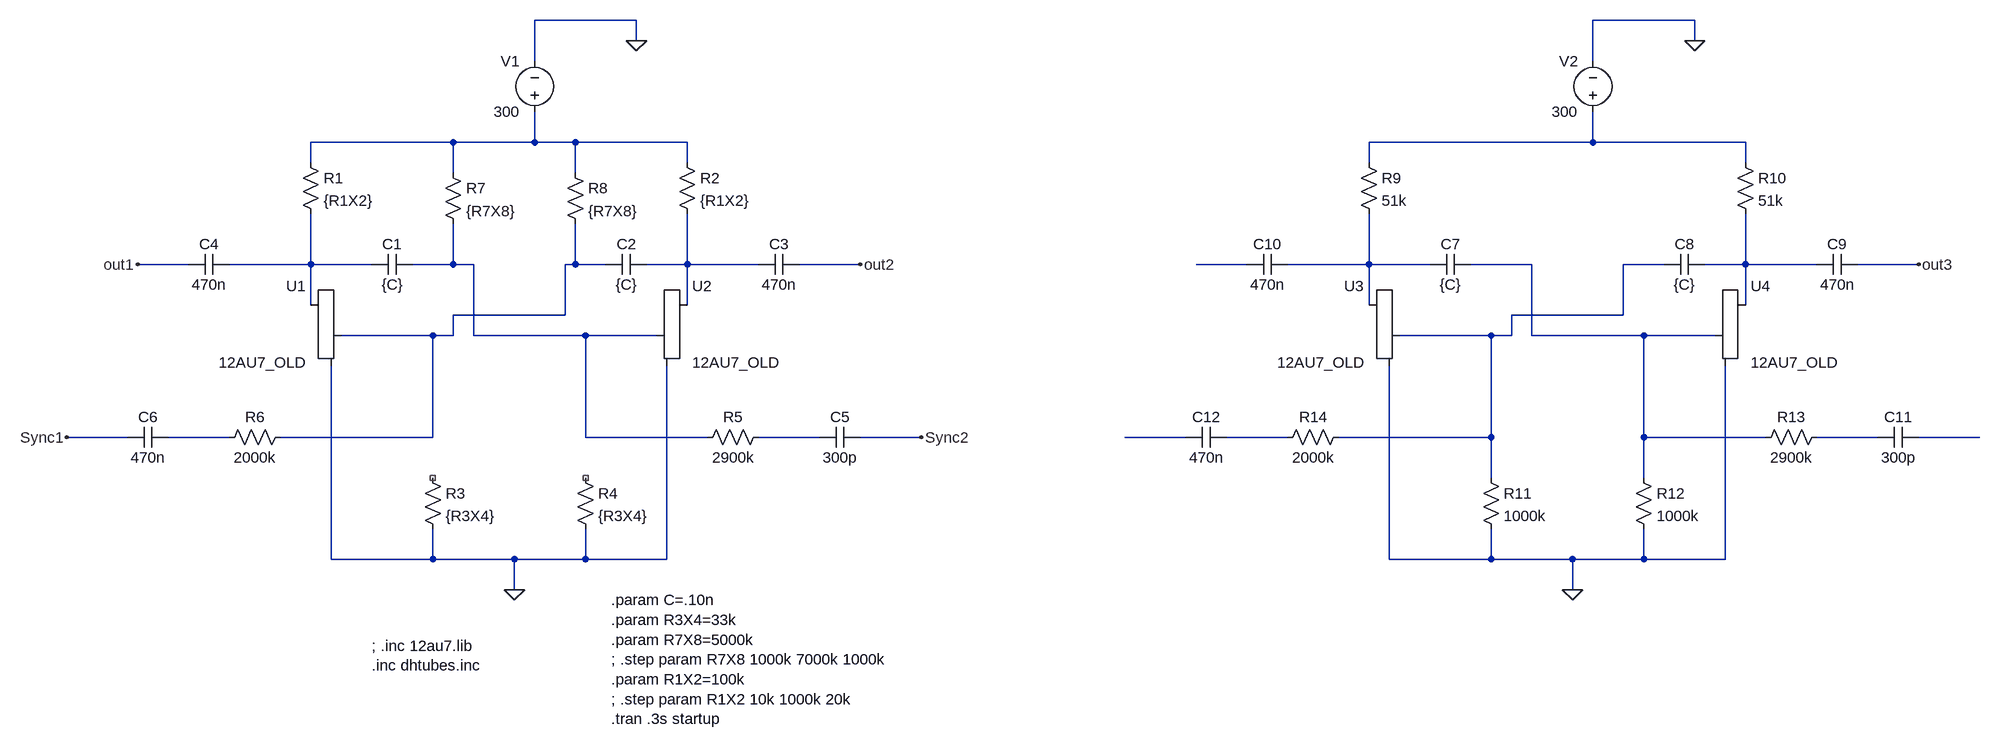
[diagram p0: schematic Multivibrator2.asc]
Multivibrator2.asc, the LTspice schematic file:
Version 4
SHEET 1 2860 824
WIRE 656 -272 496 -272
WIRE 2320 -272 2160 -272
WIRE 656 -240 656 -272
WIRE 2320 -240 2320 -272
WIRE 496 -208 496 -272
WIRE 2160 -208 2160 -272
WIRE 368 -80 144 -80
WIRE 496 -80 496 -128
WIRE 496 -80 368 -80
WIRE 560 -80 496 -80
WIRE 736 -80 560 -80
WIRE 2160 -80 2160 -128
WIRE 2160 -80 1808 -80
WIRE 2400 -80 2160 -80
WIRE 144 -48 144 -80
WIRE 736 -48 736 -80
WIRE 1808 -48 1808 -80
WIRE 2400 -48 2400 -80
WIRE 368 -32 368 -80
WIRE 560 -32 560 -80
WIRE -48 112 -128 112
WIRE 144 112 144 32
WIRE 144 112 16 112
WIRE 240 112 144 112
WIRE 368 112 368 48
WIRE 368 112 304 112
WIRE 400 112 368 112
WIRE 560 112 560 48
WIRE 560 112 544 112
WIRE 608 112 560 112
WIRE 736 112 736 32
WIRE 736 112 672 112
WIRE 848 112 736 112
WIRE 1008 112 912 112
WIRE 1616 112 1536 112
WIRE 1808 112 1808 32
WIRE 1808 112 1680 112
WIRE 1904 112 1808 112
WIRE 2064 112 1968 112
WIRE 2272 112 2208 112
WIRE 2400 112 2400 32
WIRE 2400 112 2336 112
WIRE 2512 112 2400 112
WIRE 2672 112 2576 112
WIRE 144 176 144 112
WIRE 736 176 736 112
WIRE 1808 176 1808 112
WIRE 2400 176 2400 112
WIRE 544 192 544 112
WIRE 544 192 368 192
WIRE 2208 192 2208 112
WIRE 2208 192 2032 192
WIRE 336 224 192 224
WIRE 368 224 368 192
WIRE 368 224 336 224
WIRE 400 224 400 112
WIRE 576 224 400 224
WIRE 688 224 576 224
WIRE 2000 224 1856 224
WIRE 2032 224 2032 192
WIRE 2032 224 2000 224
WIRE 2064 224 2064 112
WIRE 2240 224 2064 224
WIRE 2352 224 2240 224
WIRE -144 384 -240 384
WIRE 16 384 -80 384
WIRE 336 384 336 224
WIRE 336 384 96 384
WIRE 576 384 576 224
WIRE 768 384 576 384
WIRE 944 384 848 384
WIRE 1104 384 1008 384
WIRE 1520 384 1424 384
WIRE 1680 384 1584 384
WIRE 2000 384 2000 224
WIRE 2000 384 1760 384
WIRE 2240 384 2240 224
WIRE 2432 384 2240 384
WIRE 2608 384 2512 384
WIRE 2768 384 2672 384
WIRE 2000 448 2000 384
WIRE 2240 448 2240 384
WIRE 176 576 176 272
WIRE 336 576 336 528
WIRE 336 576 176 576
WIRE 464 576 336 576
WIRE 576 576 576 528
WIRE 576 576 464 576
WIRE 704 576 704 272
WIRE 704 576 576 576
WIRE 1840 576 1840 272
WIRE 2000 576 2000 528
WIRE 2000 576 1840 576
WIRE 2128 576 2000 576
WIRE 2240 576 2240 528
WIRE 2240 576 2128 576
WIRE 2368 576 2368 272
WIRE 2368 576 2240 576
WIRE 464 624 464 576
WIRE 2128 624 2128 576
FLAG 464 624 0
FLAG 656 -240 0
FLAG -128 112 out1
FLAG 1008 112 out2
FLAG 1104 384 Sync2
FLAG -240 384 Sync1
FLAG 2128 624 0
FLAG 2320 -240 0
FLAG 2672 112 out3
SYMBOL voltage 496 -112 R180
WINDOW 0 24 96 Left 2
WINDOW 3 24 16 Left 2
WINDOW 123 0 0 Left 0
WINDOW 39 0 0 Left 0
SYMATTR InstName V1
SYMATTR Value 300
SYMBOL Misc\\triode 144 224 M0
SYMATTR InstName U1
SYMATTR SpiceModel 12AU7_OLD
SYMATTR Value 12AU7_OLD
SYMBOL Misc\\triode 736 224 R0
SYMATTR InstName U2
SYMATTR SpiceModel 12AU7_OLD
SYMATTR Value 12AU7_OLD
SYMBOL res 128 -64 R0
SYMATTR InstName R1
SYMATTR Value {R1X2}
SYMBOL res 720 -64 R0
SYMATTR InstName R2
SYMATTR Value {R1X2}
SYMBOL cap 304 96 R90
WINDOW 0 0 32 VBottom 2
WINDOW 3 32 32 VTop 2
SYMATTR InstName C1
SYMATTR Value {C}
SYMATTR SpiceLine V=400
SYMBOL cap 672 96 R90
WINDOW 0 0 32 VBottom 2
WINDOW 3 32 32 VTop 2
SYMATTR InstName C2
SYMATTR Value {C}
SYMATTR SpiceLine V=400
SYMBOL res 320 432 R0
SYMATTR InstName R3
SYMATTR Value {R3X4}
SYMBOL res 560 432 R0
SYMATTR InstName R4
SYMATTR Value {R3X4}
SYMBOL cap 912 96 R90
WINDOW 0 0 32 VBottom 2
WINDOW 3 32 32 VTop 2
SYMATTR InstName C3
SYMATTR Value 470n
SYMBOL cap 16 96 R90
WINDOW 0 0 32 VBottom 2
WINDOW 3 32 32 VTop 2
SYMATTR InstName C4
SYMATTR Value 470n
SYMBOL res 864 368 R90
WINDOW 0 0 56 VBottom 2
WINDOW 3 32 56 VTop 2
SYMATTR InstName R5
SYMATTR Value 2900k
SYMBOL cap 1008 368 R90
WINDOW 0 0 32 VBottom 2
WINDOW 3 32 32 VTop 2
SYMATTR InstName C5
SYMATTR Value 300p
SYMBOL res 112 368 R90
WINDOW 0 0 56 VBottom 2
WINDOW 3 32 56 VTop 2
SYMATTR InstName R6
SYMATTR Value 2000k
SYMBOL cap -80 368 R90
WINDOW 0 0 32 VBottom 2
WINDOW 3 32 32 VTop 2
SYMATTR InstName C6
SYMATTR Value 470n
SYMBOL res 352 -48 R0
SYMATTR InstName R7
SYMATTR Value {R7X8}
SYMBOL res 544 -48 R0
SYMATTR InstName R8
SYMATTR Value {R7X8}
SYMBOL voltage 2160 -112 R180
WINDOW 0 24 96 Left 2
WINDOW 3 24 16 Left 2
WINDOW 123 0 0 Left 0
WINDOW 39 0 0 Left 0
SYMATTR InstName V2
SYMATTR Value 300
SYMBOL Misc\\triode 1808 224 M0
SYMATTR InstName U3
SYMATTR SpiceModel 12AU7_OLD
SYMATTR Value 12AU7_OLD
SYMBOL Misc\\triode 2400 224 R0
SYMATTR InstName U4
SYMATTR SpiceModel 12AU7_OLD
SYMATTR Value 12AU7_OLD
SYMBOL res 1792 -64 R0
SYMATTR InstName R9
SYMATTR Value 51k
SYMBOL res 2384 -64 R0
SYMATTR InstName R10
SYMATTR Value 51k
SYMBOL cap 1968 96 R90
WINDOW 0 0 32 VBottom 2
WINDOW 3 32 32 VTop 2
SYMATTR InstName C7
SYMATTR Value {C}
SYMATTR SpiceLine V=400
SYMBOL cap 2336 96 R90
WINDOW 0 0 32 VBottom 2
WINDOW 3 32 32 VTop 2
SYMATTR InstName C8
SYMATTR Value {C}
SYMATTR SpiceLine V=400
SYMBOL res 1984 432 R0
SYMATTR InstName R11
SYMATTR Value 1000k
SYMBOL res 2224 432 R0
SYMATTR InstName R12
SYMATTR Value 1000k
SYMBOL cap 2576 96 R90
WINDOW 0 0 32 VBottom 2
WINDOW 3 32 32 VTop 2
SYMATTR InstName C9
SYMATTR Value 470n
SYMBOL cap 1680 96 R90
WINDOW 0 0 32 VBottom 2
WINDOW 3 32 32 VTop 2
SYMATTR InstName C10
SYMATTR Value 470n
SYMBOL res 2528 368 R90
WINDOW 0 0 56 VBottom 2
WINDOW 3 32 56 VTop 2
SYMATTR InstName R13
SYMATTR Value 2900k
SYMBOL cap 2672 368 R90
WINDOW 0 0 32 VBottom 2
WINDOW 3 32 32 VTop 2
SYMATTR InstName C11
SYMATTR Value 300p
SYMBOL res 1776 368 R90
WINDOW 0 0 56 VBottom 2
WINDOW 3 32 56 VTop 2
SYMATTR InstName R14
SYMATTR Value 2000k
SYMBOL cap 1584 368 R90
WINDOW 0 0 32 VBottom 2
WINDOW 3 32 32 VTop 2
SYMATTR InstName C12
SYMATTR Value 470n
TEXT 616 640 Left 2 !.param C=.10n\n.param R3X4=33k\n.param R7X8=5000k\n; .step param R7X8 1000k 7000k 1000k\n.param R1X2=100k\n; .step param R1X2 10k 1000k 20k\n.tran .3s startup
TEXT 240 712 Left 2 !; .inc 12au7.lib\n.inc dhtubes.inc

The netlist it stands for:
* Multivibrator2.asc
V1 N001 0 300
XU1 N003 N005 0 12AU7_OLD 12AU7_OLD
XU2 N006 N004 0 12AU7_OLD 12AU7_OLD
R1 N001 N003 {R1X2}
R2 N001 N006 {R1X2}
C1 N004 N003 {C} V=400
C2 N006 N005 {C} V=400
R3 NC_01 0 {R3X4}
R4 NC_02 0 {R3X4}
C3 out2 N006 470n
C4 N003 out1 470n
R5 N013 N004 2900k
C5 Sync2 N013 300p
R6 N005 N012 2000k
C6 N012 Sync1 470n
R7 N001 N004 {R7X8}
R8 N001 N005 {R7X8}
V2 N002 0 300
XU3 N008 N010 0 12AU7_OLD 12AU7_OLD
XU4 N011 N009 0 12AU7_OLD 12AU7_OLD
R9 N002 N008 51k
R10 N002 N011 51k
C7 N009 N008 {C} V=400
C8 N011 N010 {C} V=400
R11 N010 0 1000k
R12 N009 0 1000k
C9 out3 N011 470n
C10 N008 N007 470n
R13 N016 N009 2900k
C11 N017 N016 300p
R14 N010 N015 2000k
C12 N015 N014 470n
.param C=.10n
.param R3X4=33k
.param R7X8=5000k
; .step param R7X8 1000k 7000k 1000k
.param R1X2=100k
; .step param R1X2 10k 1000k 20k
.tran .3s startup
; .inc 12au7.lib
.inc dhtubes.inc
.backanno
.end